# Altium schematic sheet [05] - DAC.SchDoc
size A4; DocumentNumber: 6; SheetNumber: 6; SheetTotal: 9
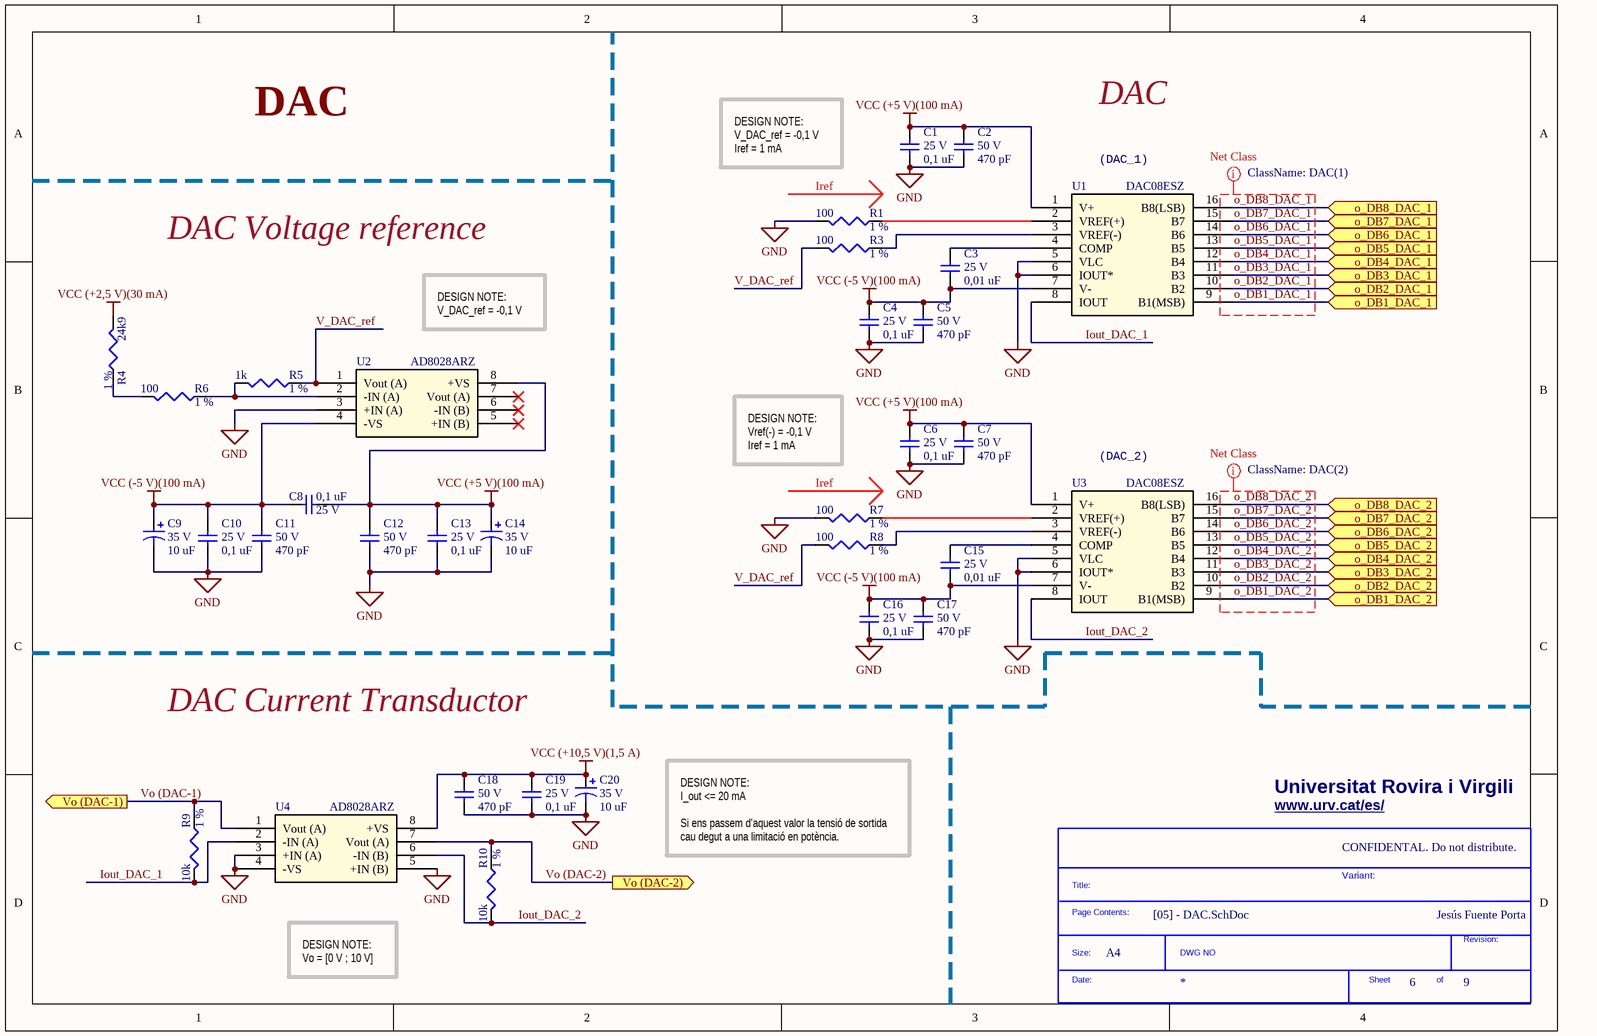
[diagram p0: [05] - DAC.SchDoc]

## Parts
*?  SDTitleBlock  (value not drawn)  (graphical)
C1  0,1 uF  Voltage: 25 V  [1206 [Métrica 3216]]
C2  470 pF  Voltage: 50 V  [1206 [Métrica 3216]]
C3  0,01 uF  Voltage: 25 V  [1206 [Métrica 3216]]
C4  0,1 uF  Voltage: 25 V  [1206 [Métrica 3216]]
C5  470 pF  Voltage: 50 V  [1206 [Métrica 3216]]
C6  0,1 uF  Voltage: 25 V  [1206 [Métrica 3216]]
C7  470 pF  Voltage: 50 V  [1206 [Métrica 3216]]
C8  0,1 uF  Voltage: 25 V  [1206 [Métrica 3216]]
C9  10 uF  Voltage: 35 V  [EEE1VA100WR]
C10  0,1 uF  Voltage: 25 V  [1206 [Métrica 3216]]
C11  470 pF  Voltage: 50 V  [1206 [Métrica 3216]]
C12  470 pF  Voltage: 50 V  [1206 [Métrica 3216]]
C13  0,1 uF  Voltage: 25 V  [1206 [Métrica 3216]]
C14  10 uF  Voltage: 35 V  [EEE1VA100WR]
C15  0,01 uF  Voltage: 25 V  [1206 [Métrica 3216]]
C16  0,1 uF  Voltage: 25 V  [1206 [Métrica 3216]]
C17  470 pF  Voltage: 50 V  [1206 [Métrica 3216]]
C18  470 pF  Voltage: 50 V  [1206 [Métrica 3216]]
C19  0,1 uF  Voltage: 25 V  [1206 [Métrica 3216]]
C20  10 uF  Voltage: 35 V  [EEE1VA100WR]
R1  100  Tolerance: 1 %  [1206 [Métrica 3216]]
R3  100  Tolerance: 1 %  [1206 [Métrica 3216]]
R4  24k9  Tolerance: 1 %  [1206 [Métrica 3216]]
R5  1k  Tolerance: 1 %  [1206 [Métrica 3216]]
R6  100  Tolerance: 1 %  [1206 [Métrica 3216]]
R7  100  Tolerance: 1 %  [1206 [Métrica 3216]]
R8  100  Tolerance: 1 %  [1206 [Métrica 3216]]
R9  10k  Tolerance: 1 %  [1206 [Métrica 3216]]
R10  10k  Tolerance: 1 %  [1206 [Métrica 3216]]
U1  DAC08ESZ  [DAC08ESZ_(R_16-M)]
U2  AD8028ARZ  [AD8028ARZ - (R_8-M)]
U3  DAC08ESZ  [DAC08ESZ_(R_16-M)]
U4  AD8028ARZ  [AD8028ARZ - (R_8-M)]

## Ports
o_DB1_DAC_1 (in), o_DB1_DAC_2 (in), o_DB2_DAC_1 (in), o_DB2_DAC_2 (in), o_DB3_DAC_1 (in), o_DB3_DAC_2 (in), o_DB4_DAC_1 (in), o_DB4_DAC_2 (in), o_DB5_DAC_1 (in), o_DB5_DAC_2 (in), o_DB6_DAC_1 (in), o_DB6_DAC_2 (in), o_DB7_DAC_1 (in), o_DB7_DAC_2 (in), o_DB8_DAC_1 (in), o_DB8_DAC_2 (in), Vo (DAC-1) (out), Vo (DAC-2) (out)

## Nets
GND: C1.2 C2.2 C4.2 C5.2 C6.2 C7.2 C9.2 C10.2 C11.2 C12.2 C13.2 C14.2 C16.2 C17.2 C18.2 C19.2 C20.2 R1.1 R7.1 U1.5(VLC) U1.6(IOUT*) U2.3(+IN_(A)) U3.5(VLC) U3.6(IOUT*) U4.3(+IN_(A)) U4.4(-VS) U4.5(+IN_(B))
VCC (+2,5 V)(30 mA): R4.1
VCC (+5 V)(100 mA): C1.1 C2.1 C6.1 C7.1 C8.2 C12.1 C13.1 C14.1 U1.1(V+) U2.8(+VS) U3.1(V+)
VCC (+10,5 V)(1,5 A): C18.1 C19.1 C20.1 U4.8(+VS)
VCC (-5 V)(100 mA): C3.2 C4.1 C5.1 C8.1 C9.1 C10.1 C11.1 C15.2 C16.1 C17.1 U1.7(V-) U2.4(-VS) U3.7(V-)
Iout_DAC_1: R9.1 U1.8(IOUT) U4.2(-IN_(A))
Iout_DAC_2: R10.1 U3.8(IOUT) U4.6(-IN_(B))
o_DB1_DAC_1: U1.9(B1(MSB)) ; port o_DB1_DAC_1
o_DB1_DAC_2: U3.9(B1(MSB)) ; port o_DB1_DAC_2
o_DB2_DAC_1: U1.10(B2) ; port o_DB2_DAC_1
o_DB2_DAC_2: U3.10(B2) ; port o_DB2_DAC_2
o_DB3_DAC_1: U1.11(B3) ; port o_DB3_DAC_1
o_DB3_DAC_2: U3.11(B3) ; port o_DB3_DAC_2
o_DB4_DAC_1: U1.12(B4) ; port o_DB4_DAC_1
o_DB4_DAC_2: U3.12(B4) ; port o_DB4_DAC_2
o_DB5_DAC_1: U1.13(B5) ; port o_DB5_DAC_1
o_DB5_DAC_2: U3.13(B5) ; port o_DB5_DAC_2
o_DB6_DAC_1: U1.14(B6) ; port o_DB6_DAC_1
o_DB6_DAC_2: U3.14(B6) ; port o_DB6_DAC_2
o_DB7_DAC_1: U1.15(B7) ; port o_DB7_DAC_1
o_DB7_DAC_2: U3.15(B7) ; port o_DB7_DAC_2
o_DB8_DAC_1: U1.16(B8(LSB)) ; port o_DB8_DAC_1
o_DB8_DAC_2: U3.16(B8(LSB)) ; port o_DB8_DAC_2
V_DAC_ref: R3.1 R5.2 R8.1 U2.1(Vout_(A))
Vo (DAC-1): R9.2 U4.1(Vout_(A)) ; port Vo (DAC-1)
Vo (DAC-2): R10.2 U4.7(Vout_(A)) ; port Vo (DAC-2)
NetC3_1: C3.1 U1.4(COMP)
NetC15_1: C15.1 U3.4(COMP)
NetR1_2: R1.2 U1.2(VREF(+))
NetR3_2: R3.2 U1.3(VREF(-))
NetR4_2: R4.2 R6.1
NetR5_1: R5.1 R6.2 U2.2(-IN_(A))
NetR7_2: R7.2 U3.2(VREF(+))
NetR8_2: R8.2 U3.3(VREF(-))

Not connected (* = marked no-connect by the designer): U2 5(+IN_(B))* 6(-IN_(B))* 7(Vout_(A))*

## Layout directives
net class DAC(1): o_DB1_DAC_1, o_DB2_DAC_1, o_DB3_DAC_1, o_DB4_DAC_1, o_DB5_DAC_1, o_DB6_DAC_1, o_DB7_DAC_1, o_DB8_DAC_1
net class DAC(2): o_DB1_DAC_2, o_DB2_DAC_2, o_DB3_DAC_2, o_DB4_DAC_2, o_DB5_DAC_2, o_DB6_DAC_2, o_DB7_DAC_2, o_DB8_DAC_2

## Notes on the sheet
- DAC
- DESIGN NOTE:
  V_DAC_ref = -0,1 V
  Iref = 1 mA
- (near U1) (DAC_1)
- ClassName: DAC(1)
- DAC Voltage reference
- (near R1) Iref
- DESIGN NOTE:
  V_DAC_ref = -0,1 V
- DESIGN NOTE:
  Vref(-) = -0,1 V
  Iref = 1 mA
- (near R7) Iref
- (near U3) (DAC_2)
- ClassName: DAC(2)
- DAC Current Transductor
- Universitat Rovira i Virgili
- DESIGN NOTE:
  I_out <= 20 mA
  Si ens passem d'aquest valor la tensió de sortida cau degut a una limitació en potència.
- www.urv.cat/es/ <http://www.urv.cat/es/>
- CONFIDENTAL. Do not distribute.
- Variant:
- Jesús Fuente Porta
- DESIGN NOTE:
  Vo = [0 V ; 10 V]
- A4
- (in symbol SDTitleBlock) Title:; Page Contents:; Revision:; Size:; DWG NO; Date:; Sheet; of

## Library data of the parts
C1 C4 C6 C8 C10 C13 C16 C19 = C0,1uF: VJ1206Y104KXXCW1BC -  Condensador de Cerámica Multicapa, 0.1 µF, 25 V, 1206 [Métrica 3216], ± 10%, X7R, VJ Series; ComponentLink1Description: Farnell Webpage; ComponentLink1URL: https://es.farnell.com/vishay/vj1206y104kxxcw1bc/conden-0-1-f-25v-10-x7r-1206/dp/2896645
C2 C5 C7 C11 C12 C17 C18 = C470pF: VJ1206A471JXACW1BC -  Condensador de Cerámica Multicapa, 470 pF, 50 V, 1206 [Métrica 3216], ± 5%, C0G / NP0, VJ Series; ComponentLink1Description: Farnell Webpage; ComponentLink1URL: https://es.farnell.com/vishay/vj1206a471jxacw1bc/conden-470pf-50v-5-c0g-np0-1206/dp/2896616
C3 C15 = C0,01uF: MCSH31B103K250CT -  Condensador de Cerámica Multicapa, 10000 pF, 25 V, 1206 [Métrica 3216], ± 10%, X7R, Serie MCSH; ComponentLink1Description: Farnell Webpage; ComponentLink1URL: https://es.farnell.com/multicomp/mcsh31b103k250ct/conden-0-01-f-25v-10-x7r-1206/dp/1856586
C9 C14 C20 = C10uF: EEE1VA100WR -  Condensador Electrolítico Aluminio SMD, Radial - SMD, 10 µF, 35 V, S Series, 1000 horas a 85°C; ComponentLink1Description: Farnell Webpage; ComponentLink1URL: https://es.farnell.com/panasonic/eee1va100wr/conden-10-f-35v-smd/dp/2808004?st=EEE1VA100WR
R1 R3 R6-R8 = R100: MCWR12X1000FTL -  Resistencia SMD de Tipo Chip, Película Gruesa, 1206 [Métrica 3216], 100 ohm, Serie MCWR, 200 V; ComponentLink1Description: Farnell Webpage; ComponentLink1URL: https://es.farnell.com/multicomp/mcwr12x1000ftl/res-100r-1-0-25w-pel-c-gruesa/dp/2447454
R4 = R24k9: MCWR12X2492FTL -  Resistencia SMD de Tipo Chip, 1206 [Métrica 3216], 24.9 kohm, MCWR12 Series, 200 V, Película Gruesa; ComponentLink1Description: Farnell Webpage; ComponentLink1URL: https://es.farnell.com/multicomp/mcwr12x2492ftl/res-24k9-1-0-25w-1206-pel-c-gruesa/dp/2695140
R5 = R1k: MCWR12X1001FTL -  Resistencia SMD de Tipo Chip, Película Gruesa, 1206 [Métrica 3216], 1 kohm, Serie MCWR, 200 V; ComponentLink1Description: Farnell Webpage; ComponentLink1URL: https://es.farnell.com/multicomp/mcwr12x1001ftl/res-1k-1-0-25w-1206-pel-c-gruesa/dp/2447473
R9 R10 = R10k: CRGCQ1206F10K -  Resistencia SMD de Tipo Chip, 1206 [Métrica 3216], 10 kohm, CRGCQ Series, 200 V, Película Gruesa; ComponentLink1Description: Farnell Webpage; ComponentLink1URL: https://es.farnell.com/te-connectivity/crgcq1206f10k/res-10k-1-1206-pel-c-gruesa/dp/2861595
U1 U3 = DAC08ESZ: DAC08ESZ -  Convertidor de Señal Digital a Analógica, 8 bit, ± 4.5V a ± 18V, NSOIC, 16 Pines; Vendor: Analog Devices Inc; Built_By: EMA_UL_Team; Manufacturer_Part_Number: DAC08ESZ; Copyright: Copyright (C) 2018 Accelerated Designs. All rights reserved; RefDes: RefDes; Type: DEV; Value: Value; ComponentLink1Description: Farnell Webpage; ComponentLink1URL: https://es.farnell.com/analog-devices/dac08esz/conv-dac-8-bits-nsoic-16/dp/2462586?ost=DAC08ESZ&ddkey=https%3Aes-ES%2FElement14_Spain%2Fsearch
U2 U4 = AD8028ARZ: AD8028ARZ -  Amplificador Operacional, Doble, 2 Amplificadores, 190 MHz, 100 V/µs, 2.7V a 12V, SOIC, 8 Pines; Vendor: Analog Devices Inc; Built_By: EMA_UL_Team; Manufacturer_Part_Number: AD8028ARZ; Copyright: Copyright (C) 2018 Accelerated Designs. All rights reserved; RefDes: RefDes; Type: DEV; Value: Value; ComponentLink1Description: Farnell Webpage; ComponentLink1URL: https://es.farnell.com/analog-devices/ad8028arz/amp-de-baja-distorsi-n-rri-o-smd/dp/1581947?ost=AD8028ARZ&ddkey=https%3Aes-ES%2FElement14_Spain%2Fsearch